# Altium schematic sheet ACS712.SchDoc
size A
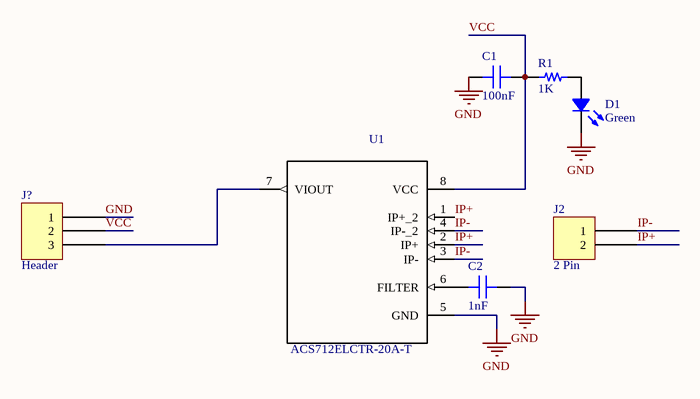
[diagram p0: ACS712.SchDoc]

## Parts
C1  100nF  [CAP 1206/3216]
C2  1nF  [CAP 1206/3216]
D1  Green  [LED 1206/3216 RED]
J2  2 Pin  [TE 282834-2]
J?  Header  [JST XH B3B-XH-A - RIGHT]
R1  1K  [RES 1206/3216]
U1  ACS712ELCTR-20A-T  [SOIC127P600X175-8N]

## Nets
GND: C1.2 C2.1 D1.2 J?.1 U1.5(GND)
IP+: J2.2 U1.1(IP+_2) U1.2(IP+)
IP-: J2.1 U1.3(IP-) U1.4(IP-_2)
VCC: C1.1 J?.2 R1.2 U1.8(VCC)
NetC2_2: C2.2 U1.6(FILTER)
NetD1_1: D1.1 R1.1
NetJ?_3: J?.3 U1.7(VIOUT)

## Library data of the parts
C1 C2 = Capacitor: SMT Capacitor; Value: 0.1uF
D1 = LED: Chip LED; Value: Green
J? = 3 Pin
R1 = Resistor: SMT Resistor; Value: 1K
U1 = ACS712ELCTR-20A-T: SENSOR CURRENT HALL 20A AC/DC; MF: Allegro; Package: SOIC-8 Allegro MicroSystems LLC; Price: 2.93 USD; MP: ACS712ELCTR-20A-T; Availability: Good; Value: *